# Altium schematic sheet MCU.SchDoc
size A4
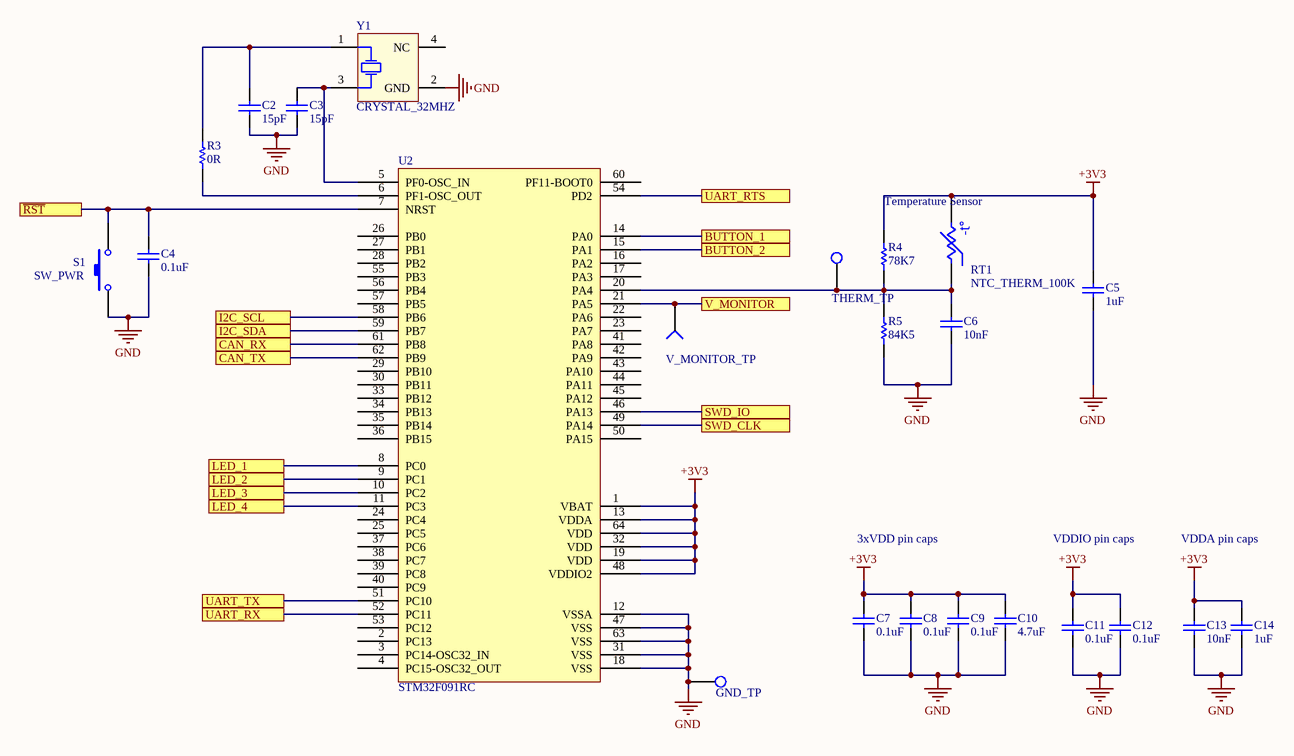
[diagram p0: MCU.SchDoc]

## Parts
C2  value 15pF  [CAPC0603(1608)55_N]  (hidden comment: CAP_15pF_0603)
C3  value 15pF  [CAPC0603(1608)55_N]  (hidden comment: CAP_15pF_0603)
C4  value 0.1uF  [CAPC0603(1608)55_N]  (hidden comment: CAP_0.1uF_16V_0603)
C5  value 1uF  [CAPC0603(1608)55_N]  (hidden comment: CAP_1uF_16V_0603)
C6  value 10nF  [CAPC0603(1608)55_N]  (hidden comment: CAP_10nF_0603)
C7  value 0.1uF  [CAPC0603(1608)55_N]  (hidden comment: CAP_0.1uF_16V_0603)
C8  value 0.1uF  [CAPC0603(1608)55_N]  (hidden comment: CAP_0.1uF_16V_0603)
C9  value 0.1uF  [CAPC0603(1608)55_N]  (hidden comment: CAP_0.1uF_16V_0603)
C10  value 4.7uF  [CAPC0603(1608)55_N]  (hidden comment: CAP_4.7uF_0603)
C11  value 0.1uF  [CAPC0603(1608)55_N]  (hidden comment: CAP_0.1uF_16V_0603)
C12  value 0.1uF  [CAPC0603(1608)55_N]  (hidden comment: CAP_0.1uF_16V_0603)
C13  value 10nF  [CAPC0603(1608)55_N]  (hidden comment: CAP_10nF_0603)
C14  value 1uF  [CAPC0603(1608)55_N]  (hidden comment: CAP_1uF_16V_0603)
R3  value 0R  [RESC0603(1608)_N]  (hidden comment: RES_0R_0603)
R4  value 78K7  [RESC0603(1608)_N]  (hidden comment: RES_78K7_0603)
R5  value 84K5  [RESC0603(1608)_N]  (hidden comment: RES_84K5_0603)
RT1  NTC_THERM_100K  [RESC0603(1608)_N]
S1  SW_PWR  [PTS830GM140]
TP3  THERM_TP  [TESTPOINT_LOOP]
TP4  V_MONITOR_TP  [TESTPOINT]
TP5  GND_TP  [TESTPOINT_LOOP]
U2  STM32F091RC  [STM_LQFP64_N]
Y1  CRYSTAL_32MHZ  [AVX-CX2520DB32000D0GEJZ1-4_V]

## Ports
BUTTON_1, BUTTON_2, CAN_RX, CAN_TX, I2C_SCL, I2C_SDA, LED_1, LED_2, LED_3, LED_4, SWD_CLK, SWD_IO, UART_RTS, UART_RX, UART_TX, V_MONITOR, ~{RST}

## Nets
+3V3: C5.2 C7.2 C8.2 C9.2 C10.2 C11.2 C12.2 C13.2 C14.2 R4.2 RT1.1 U2.1(VBAT) U2.13(VDDA) U2.19(VDD) U2.32(VDD) U2.48(VDDIO2) U2.64(VDD)
GND: C2.1 C3.1 C4.1 C5.1 C6.1 C7.1 C8.1 C9.1 C10.1 C11.1 C12.1 C13.1 C14.1 R5.1 S1.1 TP5.1(=value) U2.12(VSSA) U2.18(VSS) U2.31(VSS) U2.47(VSS) U2.63(VSS) Y1.2(GND)
~{RST}: C4.2 S1.2 U2.7(NRST) ; port ~{RST}
BUTTON_1: U2.14(PA0) ; port BUTTON_1
BUTTON_2: U2.15(PA1) ; port BUTTON_2
CAN_RX: U2.61(PB8) ; port CAN_RX
CAN_TX: U2.62(PB9) ; port CAN_TX
I2C_SCL: U2.58(PB6) ; port I2C_SCL
I2C_SDA: U2.59(PB7) ; port I2C_SDA
LED_1: U2.8(PC0) ; port LED_1
LED_2: U2.9(PC1) ; port LED_2
LED_3: U2.10(PC2) ; port LED_3
LED_4: U2.11(PC3) ; port LED_4
SWD_CLK: U2.49(PA14) ; port SWD_CLK
SWD_IO: U2.46(PA13) ; port SWD_IO
UART_RTS: U2.54(PD2) ; port UART_RTS
UART_RX: U2.52(PC11) ; port UART_RX
UART_TX: U2.51(PC10) ; port UART_TX
V_MONITOR: TP4.1(=value) U2.21(PA5) ; port V_MONITOR
NetC2_2: C2.2 R3.2 Y1.1(HOT)
NetC3_2: C3.2 U2.5(PF0-OSC_IN) Y1.3(HOT)
NetC6_2: C6.2 R4.1 R5.2 RT1.2 TP3.1(=value) U2.20(PA4)
NetR3_1: R3.1 U2.6(PF1-OSC_OUT)

Not connected (* = marked no-connect by the designer): U2 2(PC13) 3(PC14-OSC32_IN) 4(PC15-OSC32_OUT) 16(PA2) 17(PA3) 22(PA6) 23(PA7) 24(PC4) 25(PC5) 26(PB0) 27(PB1) 28(PB2) 29(PB10) 30(PB11) 33(PB12) 34(PB13) 35(PB14) 36(PB15) 37(PC6) 38(PC7) 39(PC8) 40(PC9) 41(PA8) 42(PA9) 43(PA10) 44(PA11) 45(PA12) 50(PA15) 53(PC12) 55(PB3) 56(PB4) 57(PB5) 60(PF11-BOOT0); Y1 4(NC)

## Notes on the sheet
- (near RT1) Temperature Sensor
- 3xVDD pin caps
- VDDIO pin caps
- VDDA pin caps
- (in symbol NTC_THERM_100K) -t°

## Library data of the parts
C2 C3 = CAP_15pF_0603: CAP CER 15PF 250V NPO 0603; Part Number: AC0603JRNPOYBN150; Manufacturer: Yageo; Temperature Coefficient: NP0; Dimensions: 0.063" L x 0.031" W (1.60mm x 0.80mm); Package: 0603 (1608 Metric); Voltage Rating: 250v
C4 C7-C9 C11 C12 = CAP_0.1uF_16V_0603: CAP CER 0.1UF 16V X7R 0603; Part Number: CC0603KRX7R7BB104; Manufacturer: Yageo; Dimensions: 0.063" L x 0.031" W (1.60mm x 0.80mm); Package: 0603 (1608 Metric); Temperature Coefficient: X7R; Voltage Rating: 16V
C5 C14 = CAP_1uF_16V_0603: CAP CER 1UF 16V Y5V 0603; Part Number: CC0603ZRY5V7BB105; Manufacturer: Yageo; Dimensions: 0.063" L x 0.031" W (1.60mm x 0.80mm); Package: 0603 (1608 Metric); Temperature Coefficient: Y5V; Voltage Rating: 16V
C6 C13 = CAP_10nF_0603: CAP CER 10000PF 16V X7R 0603; Part Number: CC0603KRX7R7BB103; Manufacturer: Yageo; Dimensions: 0.063" L x 0.031" W (1.60mm x 0.80mm); Package: 0603 (1608 Metric); Temperature Coefficient: X7R; Voltage Rating: 16V
C10 = CAP_4.7uF_0603: CAP CER 4.7UF 6.3V X5R 0603; Part Number: CC0603KRX5R5BB475; Manufacturer: Yageo; Dimensions: 0.063" L x 0.031" W (1.60mm x 0.80mm); Package: 0603 (1608 Metric); Temperature Coefficient: X5R; Voltage Rating: 6.3V
R3 = RES_0R_0603: RES SMD 0 OHM JUMPER 1/10W 0603; Manufacturer: Yageo; Part Number (MPN): RC0603JR-070RL; Package: 0603 (1608 Metric); Dimensions: 0.063" L x 0.031" W (1.60mm x 0.80mm)
R4 = RES_78K7_0603: RES SMD 78.7K OHM 1% 1/10W 0603; Manufacturer: Yageo; Part Number (MPN): RC0603FR-0778K7L; Package: 0603 (1608 Metric); Dimensions: 0.063" L x 0.031" W (1.60mm x 0.80mm); Tolerance: 1%; Digikey Part Number: 311-78.7KHRCT-ND
R5 = RES_84K5_0603: RES SMD 84.5K OHM 1% 1/10W 0603; Manufacturer: Yageo; Part Number (MPN): RC0603FR-0784K5L; Package: 0603 (1608 Metric); Dimensions: 0.063" L x 0.031" W (1.60mm x 0.80mm); Tolerance: 1%; Digikey Part Number: 311-84.5KHRCT-ND
RT1 = NTC_THERM_100K: THERM NTC 100KOHM 4700K 0603; MPN: ERT-J1VV104J; Manufacturer: Panasonic; Value: 100K; Digikey Part Number: P10555CT-ND
S1 = SW_PWR: Power Switch (Red); pin to pad: 2>4; Part Number: PTS830GM140 SMTR LFS; ComponentLink1Description: Datasheet; ComponentLink1URL: https://www.ckswitches.com/media/1478/pts830.pdf
TP3 TP5 = TESTPOINT_LOOP
TP4 = TESTPOINT_SMD: Part Number (MPN): *
U2 = STM32F091RC: Manufacturer: STMicroelectronics; Part Number: STM32F091RC; Package: 64-LQFP; ComponentLink1Description: Datasheet; ComponentLink1URL: https://www.st.com/content/ccc/resource/technical/document/datasheet/95/3c/2e/5b/21/09/45/a6/DM00115237.pdf/files/DM00115237.pdf/jcr:content/translations/en.DM00115237.pdf#%5B%7B%22num%22%3A96%2C%22gen%22%3A0%7D%2C%7B%22name%22%3A%22XYZ%22%7D%2C67%2C755%2Cnull%5D
Y1 = CRYSTAL_32MHZ: CRYSTAL 32MHZ 8PF SMD; Part Number: CX2520DB32000D0GPSC1; Manufacturer: Kyocera International Inc. Electronic Components; Package: 4-SMD, No Lead; Dimensions: 0.098" L x 0.079" W (2.50mm x 2.00mm)